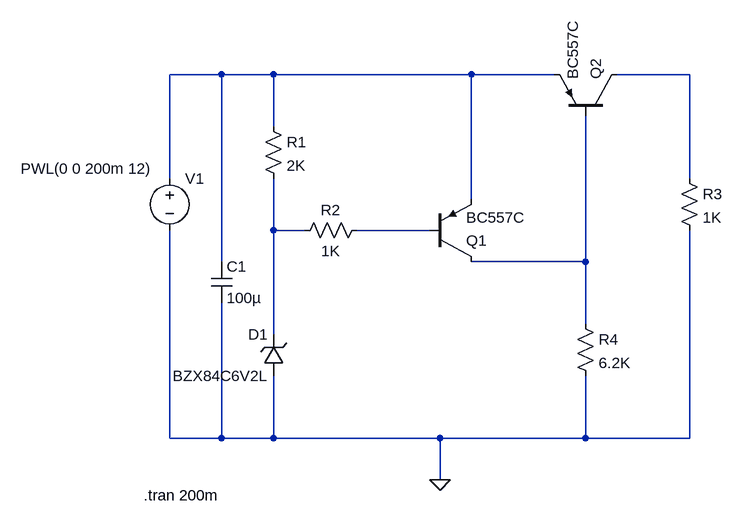
[diagram p0: schematic PNP.asc]
PNP.asc, the LTspice schematic file:
Version 4.1
SHEET 1 1192 680
WIRE 416 -32 336 -32
WIRE 496 -32 416 -32
WIRE 800 -32 496 -32
WIRE 928 -32 800 -32
WIRE 1136 -32 1024 -32
WIRE 496 48 496 -32
WIRE 336 128 336 -32
WIRE 1136 128 1136 -32
WIRE 800 160 800 -32
WIRE 496 208 496 128
WIRE 544 208 496 208
WIRE 736 208 624 208
WIRE 416 256 416 -32
WIRE 976 256 976 32
WIRE 976 256 800 256
WIRE 976 352 976 256
WIRE 496 368 496 208
WIRE 336 528 336 208
WIRE 416 528 416 320
WIRE 416 528 336 528
WIRE 496 528 496 432
WIRE 496 528 416 528
WIRE 752 528 496 528
WIRE 976 528 976 432
WIRE 976 528 752 528
WIRE 1136 528 1136 208
WIRE 1136 528 976 528
WIRE 752 592 752 528
FLAG 752 592 0
SYMBOL voltage 336 112 R0
WINDOW 3 -229 1 Left 2
WINDOW 123 0 0 Left 0
WINDOW 39 0 0 Left 0
SYMATTR InstName V1
SYMATTR Value PWL(0 0 200m 12)
SYMBOL zener 512 432 R180
WINDOW 0 24 64 Left 2
WINDOW 3 24 0 Left 2
SYMATTR InstName D1
SYMATTR Value BZX84C6V2L
SYMBOL res 640 192 R90
WINDOW 0 0 56 VBottom 2
WINDOW 3 32 56 VTop 2
SYMATTR InstName R2
SYMATTR Value 1K
SYMATTR SpiceLine tol=1 pwr=0.1
SYMBOL res 1120 112 R0
SYMATTR InstName R3
SYMATTR Value 1K
SYMATTR SpiceLine tol=1 pwr=0.1
SYMBOL res 960 336 R0
SYMATTR InstName R4
SYMATTR Value 6.2K
SYMATTR SpiceLine tol=1 pwr=0.1
SYMBOL pnp 736 256 M180
SYMATTR InstName Q1
SYMATTR Value BC557C
SYMBOL pnp 1024 32 M270
SYMATTR InstName Q2
SYMATTR Value BC557C
SYMBOL res 480 32 R0
SYMATTR InstName R1
SYMATTR Value 2K
SYMATTR SpiceLine tol=1 pwr=0.1
SYMBOL cap 400 256 R0
WINDOW 3 24 56 Left 2
SYMATTR InstName C1
SYMATTR Value 100µ
SYMATTR Description Capacitor
SYMATTR Type cap
SYMATTR SpiceLine V=10 Irms=0 Rser=0.1 Lser=0 mfg="AVX" pn="TPSD107M010R0100" type="Tantalum"
TEXT 296 616 Left 2 !.tran 200m

The netlist it stands for:
* PNP.asc
V1 N001 0 PWL(0 0 200m 12)
D1 0 N003 BZX84C6V2L
R2 N004 N003 1K tol=1 pwr=0.1
R3 N002 0 1K tol=1 pwr=0.1
R4 N005 0 6.2K tol=1 pwr=0.1
Q1 N005 N004 N001 0 BC557C
Q2 N002 N005 N001 0 BC557C
R1 N001 N003 2K tol=1 pwr=0.1
C1 N001 0 100µ V=10 Irms=0 Rser=0.1 Lser=0 mfg="AVX" pn="TPSD107M010R0100" type="Tantalum"
.model D D
.lib standard.dio
.model NPN NPN
.model PNP PNP
.lib standard.bjt
.tran 200m
.backanno
.end